# EAGLE design main (EAGLE 8.3.1)
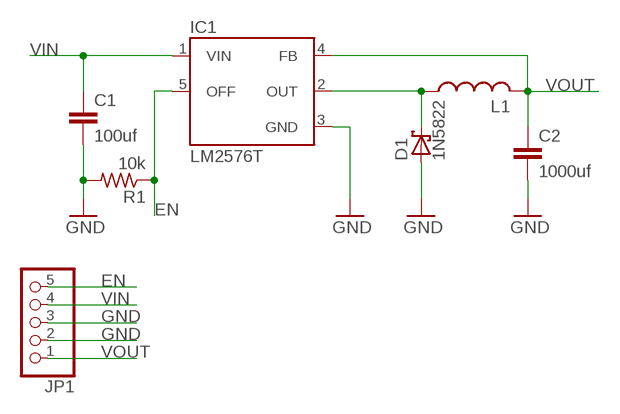
[diagram p0: schematic, sheet 1]

## Parts
C1  100uf  C-EU050-075X075  [C050-075X075]
C2  1000uf  C-EU050-075X075  [C050-075X075]
D1  1N5822  SCHOTTKY-DIODECB417-15  [CB417-15]
IC1  LM2576T  [TO220-5]
JP1  PINHD-1X5/90  [1X05/90]
L1  L-USTJ3-U1  [TJ3-U1]
R1  10k  R-US_0207/7  [0207/7]

## Nets
EN: IC1.5(OFF) JP1.5 R1.1
GND: C1.2 C2.2 D1.A IC1.3(GND) JP1.2 JP1.3 R1.2
N$3: D1.C IC1.2(OUT) L1.1
VIN: C1.1 IC1.1(VIN) JP1.4
VOUT: C2.1 IC1.4(FB) JP1.1 L1.2

## Library data of the parts
C1 C2 = rcl:C-EU: CAPACITOR, European symbol
D1 = diode:SCHOTTKY-DIODE: Schottky Diode
IC1 = v-reg-3:LM2576: National Semiconductor <http://www.national.com> 3.0A "Simple Switcher"(c) 52kHz, Vout 1.23-37V (HV: 57V), Vin 40V (HV: 60V), 50µA standby current
JP1 = pinhead:PINHD-1X5: PIN HEADER
L1 = resistor:L-US: INDUCTOR, American symbol
R1 = rcl:R-US_: RESISTOR, American symbol

## Board
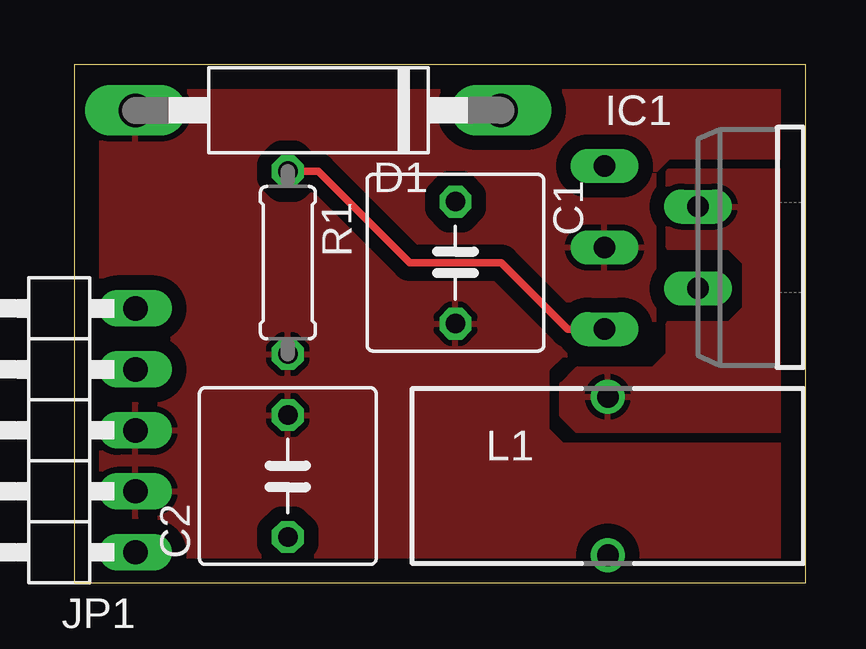
[diagram p1: board, top side]
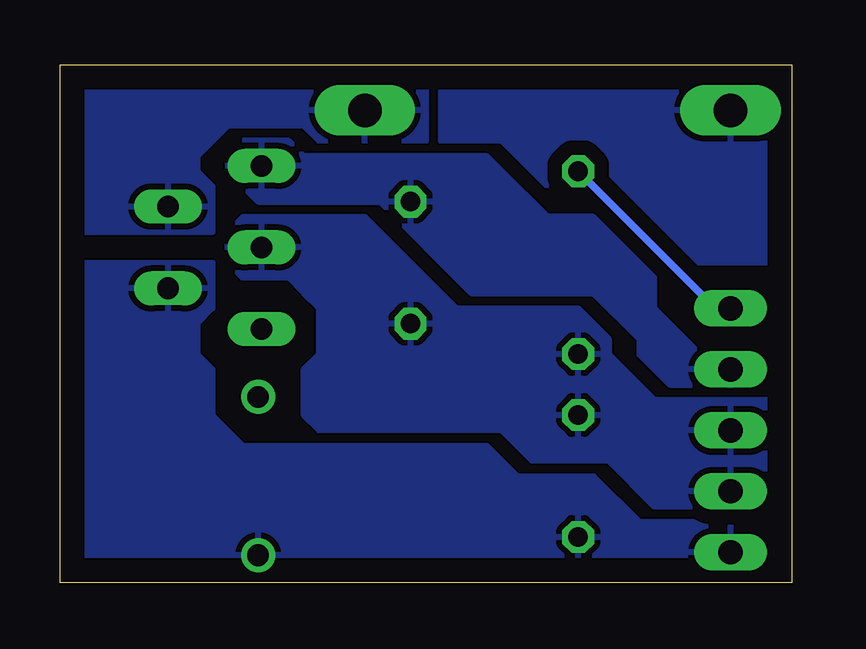
[diagram p2: board, bottom side, seen from below]

Size 30.48 x 21.59 mm. Coordinates in mm from the lower left corner, seen from the top.
Outline: 0,0 30.48,0 30.48,21.59 0,21.59 0,0
Copper layers (1*16): Top 0.035mm / dielectric 1.5mm / Bottom 0.035mm
Design rules "default": minimum track width 6mil, minimum drill 0.35mm, track to track 6mil, track to pad 6mil, pad to pad 6mil, via to via 6mil, smd to smd 6mil, copper to edge 40mil, drill to drill 6mil, minimum pad ring 10mil, minimum via ring 8mil, stop-mask expansion 4mil, vias tented up to drill 0mil, thermal gap 10mil

### Footprints (pad centres in the part's own frame; a part is rotated, then mirrored left to right if it is on the bottom)
C050-075X075 = drill 0.813 octagon: 1 -2.54,0; 2 2.54,0
CB417-15 = drill 1.397 long: A 7.62,0; C -7.62,0
TO220-5 = drill 0.9 long: 1 -3.4,-8.4; 2 -1.7,-4.5; 3 0,-8.4; 4 1.7,-4.5; 5 3.4,-8.4
1X05/90 = drill 1.016 long: 1 -5.08,-3.81; 2 -2.54,-3.81; 3 0,-3.81; 4 2.54,-3.81; 5 5.08,-3.81
TJ3-U1 = drill 0.9: 1 -3.3,0; 2 3.3,0
0207/7 = drill 0.813 octagon: 1 -3.81,0; 2 3.81,0

### Placement (x,y rotation side)
C1  15.88,13.34 270 top
C2  8.89,4.45 90 top
D1  10.16,19.68 180 top
IC1  30.48,13.97 270 top
JP1  -1.27,6.35 90 top
L1  22.23,4.45 270 top
R1  8.89,13.34 270 top

### Tracks (layer width: path | path; a pad name or v marks a point on that pad's centre or on a via)
EN
  Top 0.305: R1.1 10.16,17.14 13.97,13.34 17.78,13.34 20.55,10.57 IC1.5
  Bottom 0.305: JP1.5 3.17,11.43 R1.1
GND
  pour Bottom: 0,6.98 0,3.17 5.71,3.17 7.62,5.08 10.8,5.08 12.07,6.35 19.69,6.35 20.32,6.98 20.32,8.89 19.69,9.52 19.69,11.43 20.32,12.06 20.96,12.7 22.86,12.7 23.5,13.34 23.5,14.61 22.86,15.24 17.78,15.24 13.97,11.43 8.89,11.43 7.62,10.16 7.62,9.52 5.71,7.62 0,7.62
  pour Top (isolate 0.61): 0,0 30.48,0 30.48,5.71 20.96,5.71 20.32,5.71 19.69,6.35 19.69,8.89 20.32,9.52 23.5,9.52 24.13,10.16 24.13,17.14 24.77,17.78 30.48,17.78 30.48,21.59 0,21.59
  pour Bottom (isolate 0.61): 0,13.34 5.08,13.34 7.62,15.88 9.53,15.88 12.07,18.41 14.61,18.41 14.61,21.59 0,21.59
N$3
  pour Bottom (isolate 0.61): 24.13,14.61 30.48,14.61 30.48,21.59 15.24,21.59 15.24,18.41 19.69,18.41 20.32,19.05 23.5,19.05 24.77,17.78 24.77,17.14 24.13,16.51
  pour Top: 24.77,13.97 24.77,17.14 30.48,17.14 30.48,6.35 20.96,6.35 20.32,6.98 20.32,8.25 20.96,8.89 24.13,8.89 24.77,9.52 24.77,10.79 27.3,10.79 27.94,11.43 27.94,13.34 27.3,13.97
VIN
  pour Bottom: 20.96,18.41 22.86,18.41 23.5,17.78 23.5,17.14 22.86,16.51 22.23,15.88 17.14,15.88 13.34,12.06 8.25,12.06 6.35,10.16 6.35,9.52 5.08,8.25 0,8.25 0,9.52 3.81,9.52 4.44,10.16 5.08,10.79 5.71,11.43 5.71,12.7 8.25,15.24 10.16,15.24 12.07,17.14 12.7,17.78 20.32,17.78
VOUT
  pour Bottom (isolate 0.61): 0,2.54 0,0 30.48,0 30.48,13.34 24.13,13.34 24.13,11.43 24.77,10.79 24.77,9.52 24.13,8.89 24.13,6.98 22.86,5.71 12.7,5.71 11.43,4.45 8.25,4.45 6.35,2.54